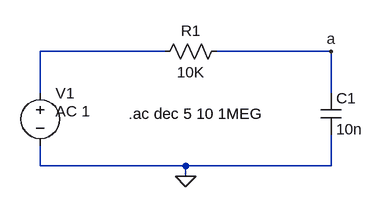
[diagram p0: schematic Pracitca4.asc]
Pracitca4.asc, the LTspice schematic file:
Version 4
SHEET 1 1204 680
WIRE 176 -848 -16 -848
WIRE 432 -848 256 -848
WIRE -16 -784 -16 -848
WIRE 432 -784 432 -848
WIRE -16 -672 -16 -704
WIRE 208 -672 -16 -672
WIRE 432 -672 432 -720
WIRE 432 -672 208 -672
WIRE 208 -656 208 -672
FLAG 208 -656 0
FLAG 432 -848 a
SYMBOL res 160 -832 R270
WINDOW 0 32 56 VTop 2
WINDOW 3 0 56 VBottom 2
SYMATTR InstName R1
SYMATTR Value 10K
SYMBOL cap 416 -784 R0
SYMATTR InstName C1
SYMATTR Value 10n
SYMBOL voltage -16 -800 R0
WINDOW 123 24 44 Left 2
WINDOW 39 0 0 Left 0
SYMATTR Value2 AC 1
SYMATTR InstName V1
SYMATTR Value ""
TEXT 120 -752 Left 2 !.ac dec 5 10 1MEG

The netlist it stands for:
* Pracitca4.asc
R1 N001 a 10K
C1 a 0 10n
V1 N001 0 AC 1
.ac dec 5 10 1MEG
.backanno
.end

* Results of the author's LTspice run, read from the files saved beside the schematic
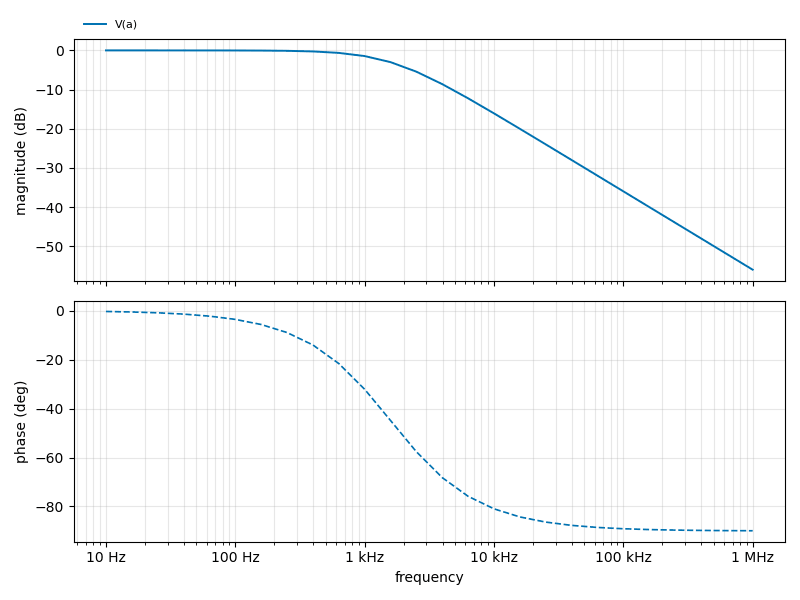
[diagram p1: AC Analysis of Pracitca4.asc, plotted from the saved traces]
* AC Analysis, 1 run:
*   V(a): -0.00 dB at 10 Hz, -55.96 dB at 1 MHz, peak -0.00 dB at 10 Hz, 3 dB below the peak at 1.59 kHz